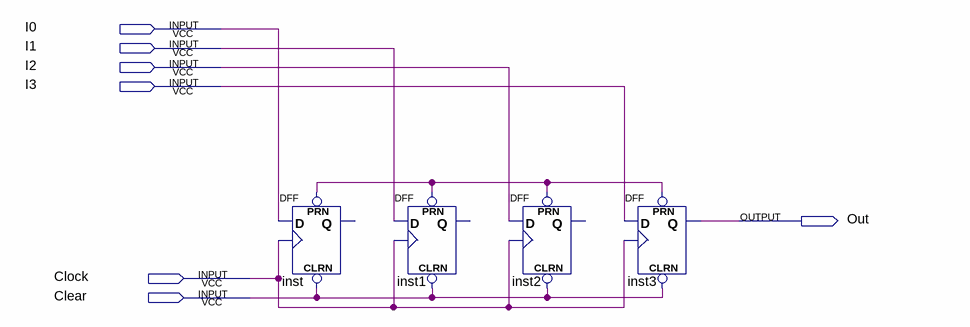
[diagram p0: schematic sheet]
// Quartus schematic 4dffSaidaSerial.bdf as structural Verilog: 4 symbols, 7 pins
module \4dffSaidaSerial  (
  input  I0,
  input  I1,
  input  I2,
  input  I3,
  input  Clock,
  input  Clear,
  output Out
);

  wire undriven;

  DFF inst (.CLRN(Clear), .CLK(Clock), .D(I0), .PRN(undriven));  // open: Q
  DFF inst1 (.CLRN(Clear), .CLK(Clock), .D(I1), .PRN(undriven));  // open: Q
  DFF inst2 (.CLRN(Clear), .CLK(Clock), .D(I2), .PRN(undriven));  // open: Q
  DFF inst3 (.CLRN(Clear), .CLK(Clock), .D(I3), .PRN(undriven), .Q(Out));
endmodule
